# EAGLE schematic Memory Breakout Board (EAGLE 8.5.1)
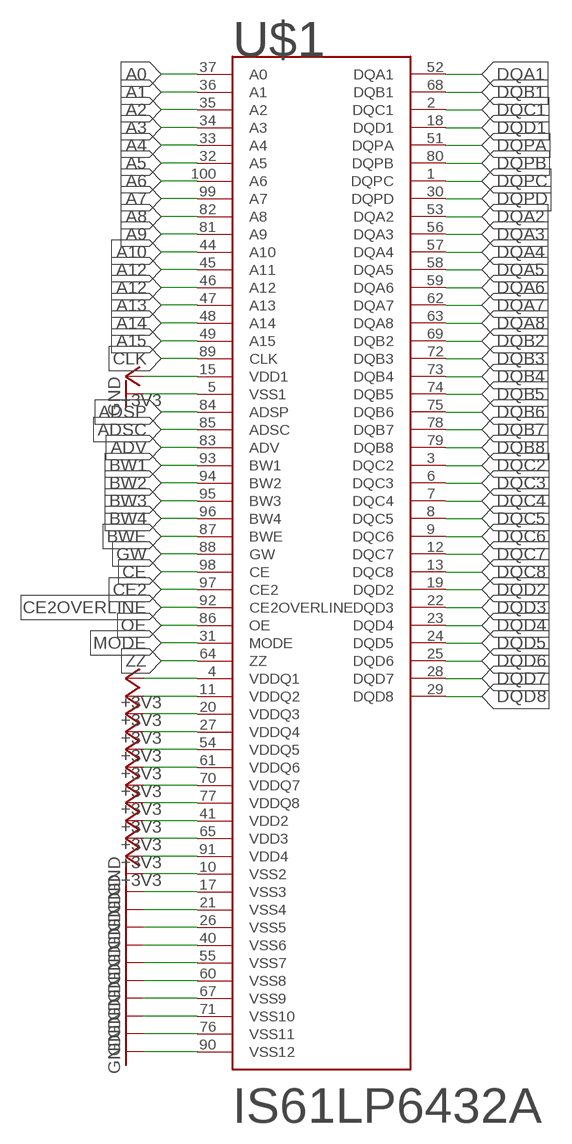
[diagram p0: schematic, sheet 1]

## Parts
U$1  IS61LP6432A  [IS61LP6432A]

## Nets
+3V3: U$1.4(VDDQ1) U$1.11(VDDQ2) U$1.15(VDD1) U$1.20(VDDQ3) U$1.27(VDDQ4) U$1.41(VDD2) U$1.54(VDDQ5) U$1.61(VDDQ6) U$1.65(VDD3) U$1.70(VDDQ7) U$1.77(VDDQ8) U$1.91(VDD4)
A0: U$1.37(A0)
A1: U$1.36(A1)
A2: U$1.35(A2)
A3: U$1.34(A3)
A4: U$1.33(A4)
A5: U$1.32(A5)
A6: U$1.100(A6)
A7: U$1.99(A7)
A8: U$1.82(A8)
A9: U$1.81(A9)
A10: U$1.44(A10)
A12: U$1.45(A11)
A13: U$1.47(A13)
A14: U$1.48(A14)
A15: U$1.49(A15)
ADSC: U$1.85(ADSC)
ADSP: U$1.84(ADSP)
ADV: U$1.83(ADV)
BW1: U$1.93(BW1)
BW2: U$1.94(BW2)
BW3: U$1.95(BW3)
BW4: U$1.96(BW4)
BWE: U$1.87(BWE)
CE: U$1.98(CE)
CE2: U$1.97(CE2)
CE2OVERLINE: U$1.92(CE2OVERLINE)
CLK: U$1.89(CLK)
DQA1: U$1.52(DQA1)
DQA2: U$1.53(DQA2)
DQA3: U$1.56(DQA3)
DQA4: U$1.57(DQA4)
DQA5: U$1.58(DQA5)
DQA6: U$1.59(DQA6)
DQA7: U$1.62(DQA7)
DQA8: U$1.63(DQA8)
DQB1: U$1.68(DQB1)
DQB2: U$1.69(DQB2)
DQB3: U$1.72(DQB3)
DQB4: U$1.73(DQB4)
DQB5: U$1.74(DQB5)
DQB6: U$1.75(DQB6)
DQB7: U$1.78(DQB7)
DQB8: U$1.79(DQB8)
DQC1: U$1.2(DQC1)
DQC2: U$1.3(DQC2)
DQC3: U$1.6(DQC3)
DQC4: U$1.7(DQC4)
DQC5: U$1.8(DQC5)
DQC6: U$1.9(DQC6)
DQC7: U$1.12(DQC7)
DQC8: U$1.13(DQC8)
DQD1: U$1.18(DQD1)
DQD2: U$1.19(DQD2)
DQD3: U$1.22(DQD3)
DQD4: U$1.23(DQD4)
DQD5: U$1.24(DQD5)
DQD6: U$1.25(DQD6)
DQD7: U$1.28(DQD7)
DQD8: U$1.29(DQD8)
DQPA: U$1.51(DQPA)
DQPB: U$1.80(DQPB)
DQPC: U$1.1(DQPC)
DQPD: U$1.30(DQPD)
GND: U$1.5(VSS1) U$1.10(VSS2) U$1.17(VSS3) U$1.21(VSS4) U$1.26(VSS5) U$1.40(VSS6) U$1.55(VSS7) U$1.60(VSS8) U$1.67(VSS9) U$1.71(VSS10) U$1.76(VSS11) U$1.90(VSS12)
GW: U$1.88(GW)
MODE: U$1.31(MODE)
N$14: U$1.46(A12)
OE: U$1.86(OE)
ZZ: U$1.64(ZZ)

## Library data of the parts
U$1 = memory:IS61LP6432A